# EAGLE design Plan_04_neu_02 (EAGLE 8.3.1)
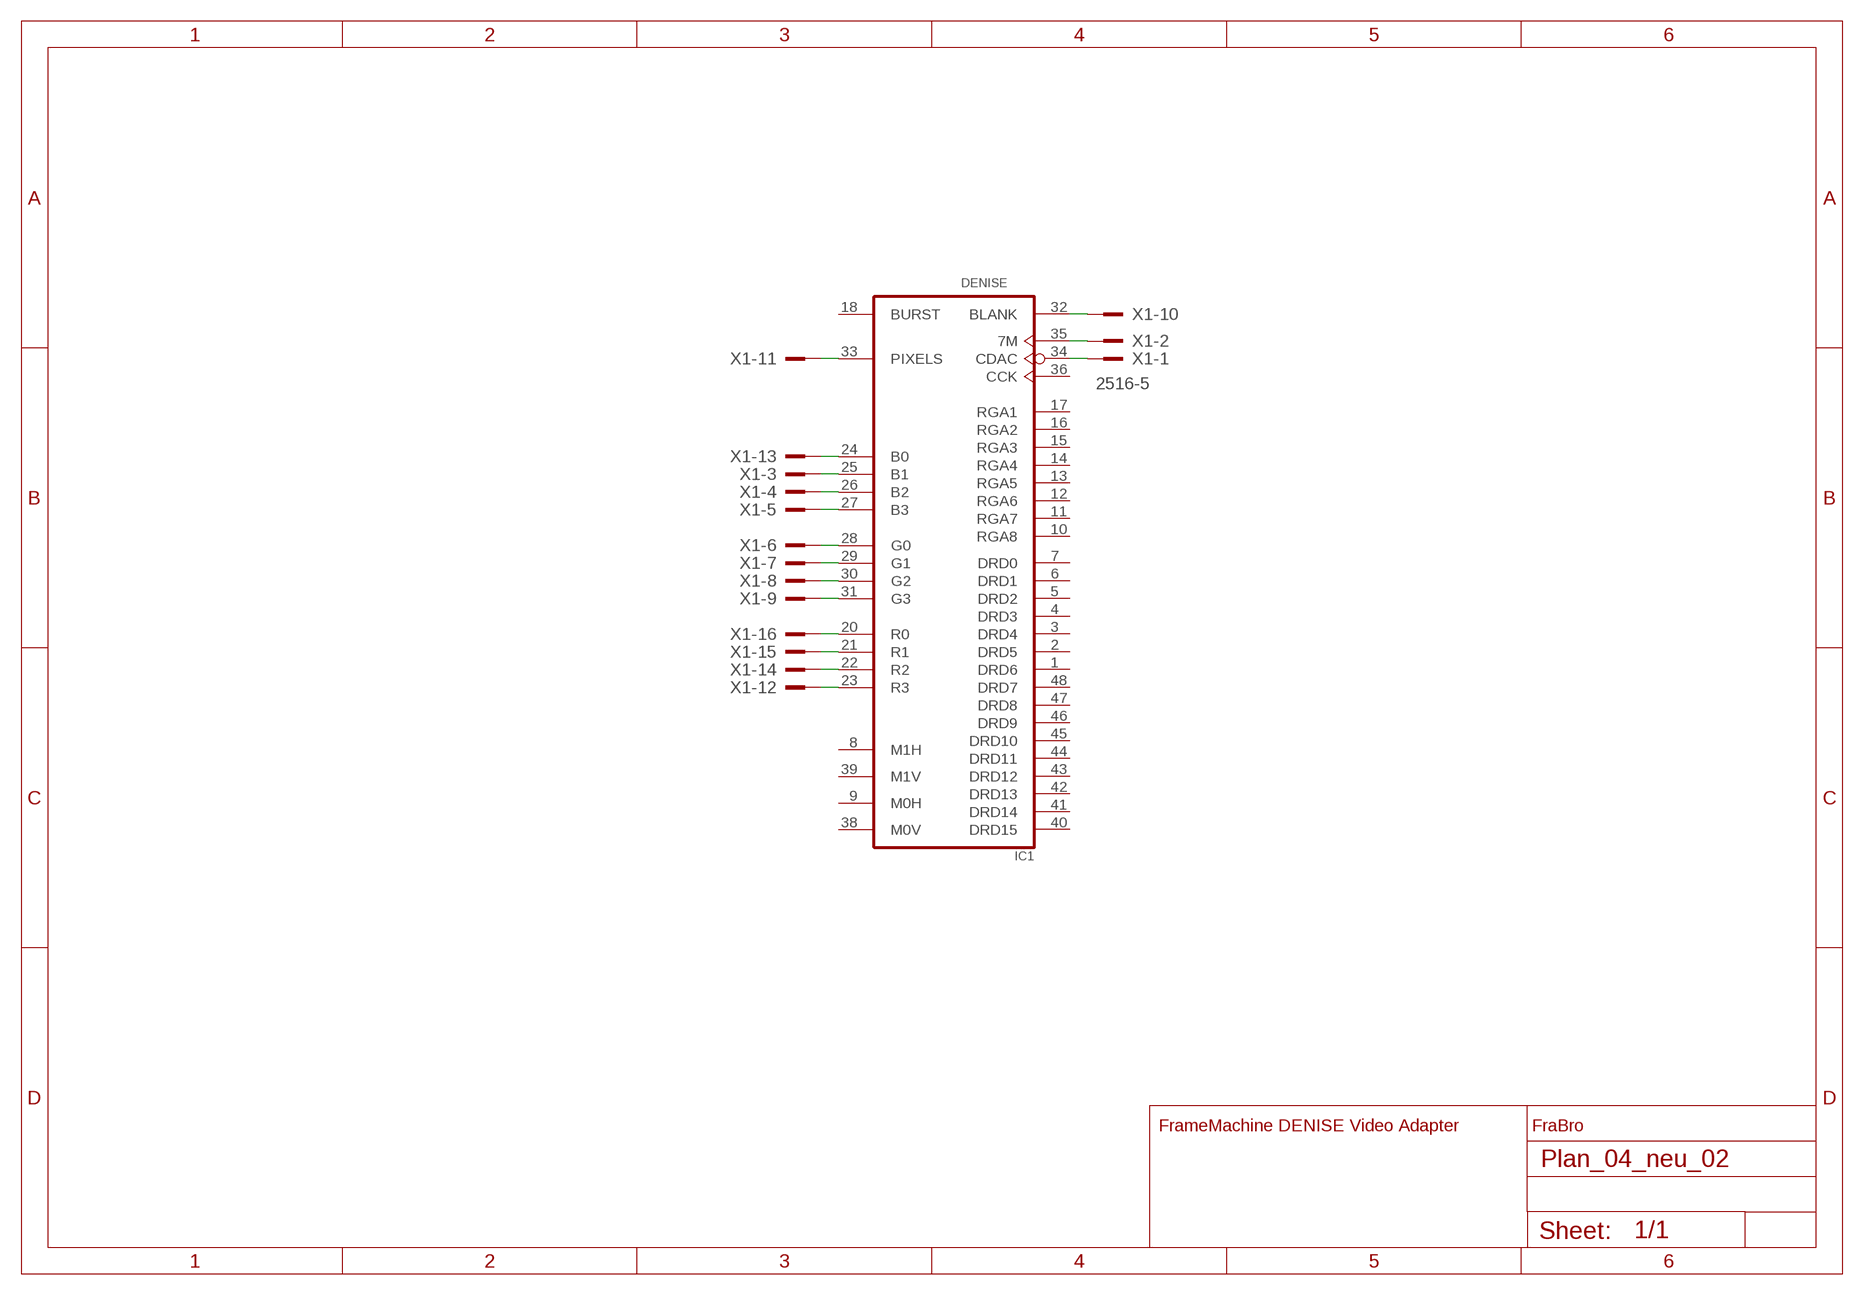
[diagram p0: schematic, sheet 1]

## Parts
IC1  Plug Socket  DENISE_DIP  [DIP48-6]
X1  2516-5  [PAK100/2500-5-16]

## Nets
N$1: IC1.20(R0) X1.16
N$2: IC1.21(R1) X1.15
N$3: IC1.22(R2) X1.14
N$4: IC1.24(B0) X1.13
N$5: IC1.23(R3) X1.12
N$6: IC1.33(PIXELS) X1.11
N$7: IC1.30(G2) X1.8
N$8: IC1.32(BLANK) X1.10
N$9: IC1.31(G3) X1.9
N$10: IC1.29(G1) X1.7
N$11: IC1.28(G0) X1.6
N$12: IC1.27(B3) X1.5
N$13: IC1.25(B1) X1.3
N$14: IC1.26(B2) X1.4
N$15: IC1.35(7M) X1.2
N$16: IC1.34(CDAC) X1.1
Unconnected: IC1.1(DRD6) IC1.2(DRD5) IC1.3(DRD4) IC1.4(DRD3) IC1.5(DRD2) IC1.6(DRD1) IC1.7(DRD0) IC1.8(M1H) IC1.9(M0H) IC1.10(RGA8) IC1.11(RGA7) IC1.12(RGA6) IC1.13(RGA5) IC1.14(RGA4) IC1.15(RGA3) IC1.16(RGA2) IC1.17(RGA1) IC1.18(BURST) IC1.36(CCK) IC1.38(M0V) IC1.39(M1V) IC1.40(DRD15) IC1.41(DRD14) IC1.42(DRD13) IC1.43(DRD12) IC1.44(DRD11) IC1.45(DRD10) IC1.46(DRD9) IC1.47(DRD8) IC1.48(DRD7)

## Notes on the sheet
- FrameMachine DENISE Video Adapter | FraBro

## Power pins joined to a net without a drawn wire
GND1: IC1.37(GND1)
VCC1: IC1.19(VCC1)

## Library data of the parts
IC1 = Amiga:DENISE
X1 = con-3m:2516-: 3M (TM) Pak 100 4-Wall Header Source: 3M; MPN: D2516-5002-AR; OC_FARNELL: 9838376; OC_NEWARK: 12P7055

## Board
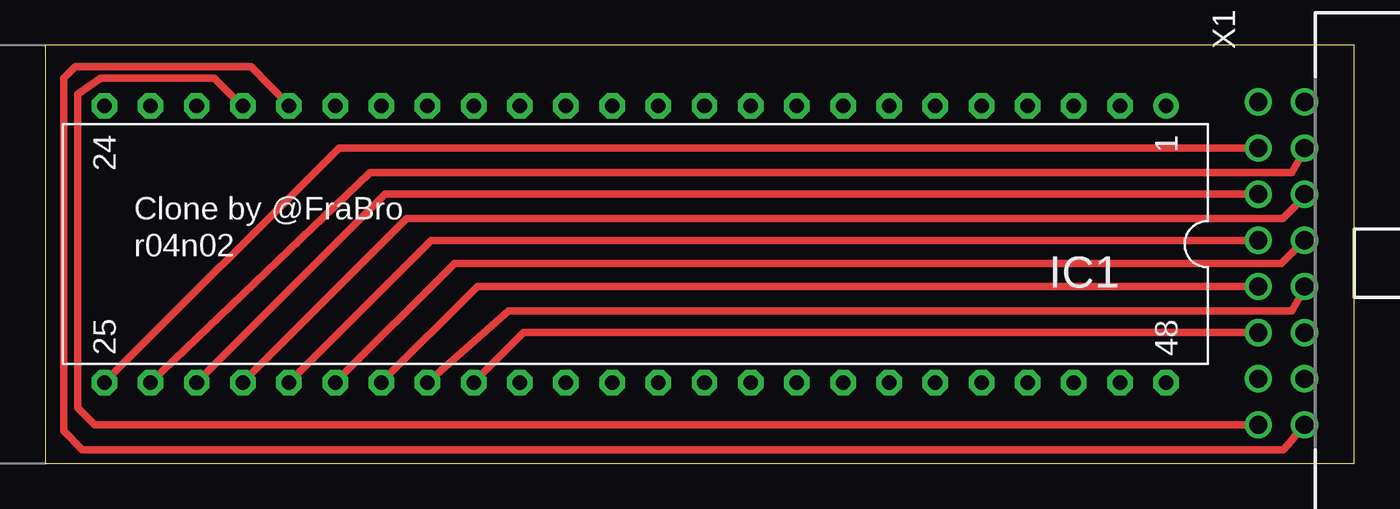
[diagram p1: board, top side]
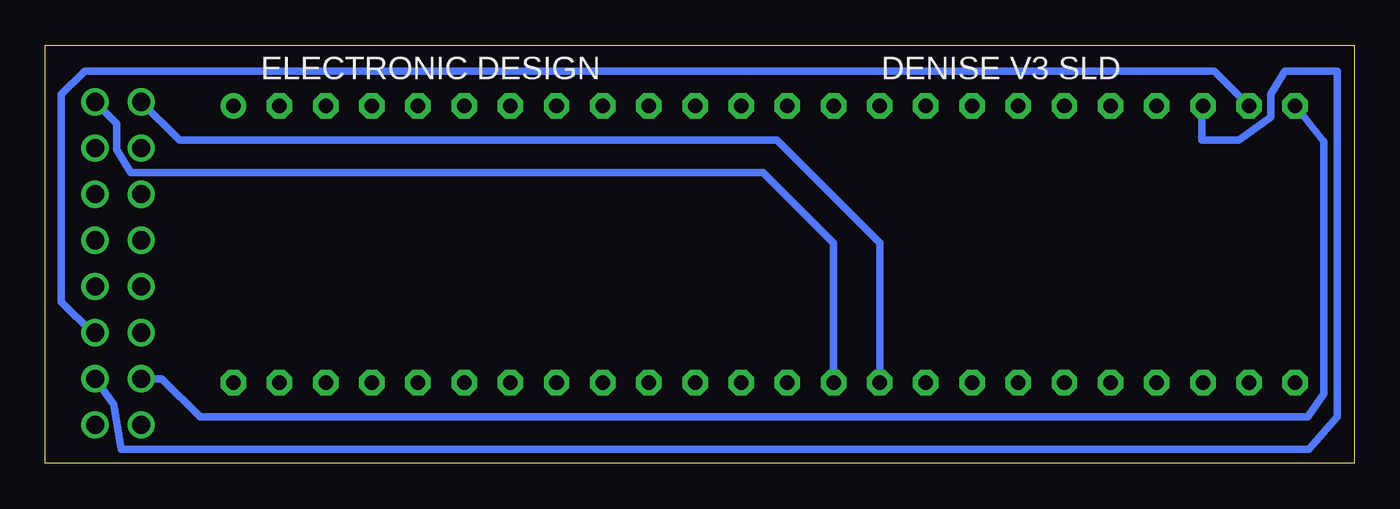
[diagram p2: board, bottom side, seen from below]

Size 72 x 23 mm. Coordinates in mm from the lower left corner, seen from the top.
Outline: 0,0 72,0 72,23 0,23 0,0
Copper layers (1*16): Top 0.0356mm / dielectric 1.5011mm / Bottom 0.0356mm
Design rules "oshpark-2layer": minimum track width 6mil, minimum drill 13mil, track to track 6mil, track to pad 6mil, pad to pad 6mil, via to via 6mil, smd to smd 6mil, copper to edge 15mil, drill to drill 6mil, minimum pad ring 7mil, minimum via ring 7mil, stop-mask expansion 2.5mil, vias tented up to drill 0mil, thermal gap 10mil

### Footprints (pad centres in the part's own frame; a part is rotated, then mirrored left to right if it is on the bottom)
DIP48-6 = drill 0.8 pad 1.4: 1 -27.94,-7.62 | drill 0.8 pad 1.4 octagon: 2 -25.4,-7.62; 3 -22.86,-7.62; 4 -20.32,-7.62; 5 -17.78,-7.62; 6 -15.24,-7.62; 7 -12.7,-7.62; 8 -10.16,-7.62; 9 -7.62,-7.62; 10 -5.08,-7.62; 11 -2.54,-7.62; 12 0,-7.62; 13 2.54,-7.62; 14 5.08,-7.62; 15 7.62,-7.62; 16 10.16,-7.62; 17 12.7,-7.62; 18 15.24,-7.62; 19 17.78,-7.62; 20 20.32,-7.62; 21 22.86,-7.62; 22 25.4,-7.62; 23 27.94,-7.62; 24 30.48,-7.62; 25 30.48,7.62; 26 27.94,7.62; 27 25.4,7.62; 28 22.86,7.62; 29 20.32,7.62; 30 17.78,7.62; 31 15.24,7.62; 32 12.7,7.62; 33 10.16,7.62; 34 7.62,7.62; 35 5.08,7.62; 36 2.54,7.62; 37 0,7.62; 38 -2.54,7.62; 39 -5.08,7.62; 40 -7.62,7.62; 41 -10.16,7.62; 42 -12.7,7.62; 43 -15.24,7.62; 44 -17.78,7.62; 45 -20.32,7.62; 46 -22.86,7.62; 47 -25.4,7.62; 48 -27.94,7.62
PAK100/2500-5-16 = drill 1 pad 1.422: 1 -8.89,-1.27; 2 -8.89,1.27; 3 -6.35,-1.27; 4 -6.35,1.27; 5 -3.81,-1.27; 6 -3.81,1.27; 7 -1.27,-1.27; 8 -1.27,1.27; 9 1.27,-1.27; 10 1.27,1.27; 11 3.81,-1.27; 12 3.81,1.27; 13 6.35,-1.27; 14 6.35,1.27; 15 8.89,-1.27; 16 8.89,1.27

### Placement (x,y rotation side)
IC1  33.72,12.06 180 top
X1  68,11 270 top

### Tracks (layer width: path | path; a pad name or v marks a point on that pad's centre or on a via)
N$1
  Top 0.406: X1.16 68.99,1.83 68.58,1.27 68.1,0.74 2.03,0.74 1.02,1.78 1.02,21.18 1.65,21.82 11.31,21.82 IC1.20
N$2
  Top 0.406: X1.15 2.72,2.11 1.78,3.05 1.78,20.32 3.05,21.18 9.3,21.18 10.8,19.68 IC1.21
N$3
  Bottom 0.406: X1.14 68.25,3.23 67.82,0.76 2.49,0.76 0.91,2.54 0.91,21.59 3.81,21.59 4.57,20.32 4.57,19.05 6.35,17.78 8.38,17.78 8.38,19.11 IC1.22
N$4
  Bottom 0.406: X1.13 65.61,4.65 63.5,2.54 2.54,2.54 1.68,3.81 1.68,17.71 IC1.24
N$5
  Bottom 0.406: X1.12 69.42,7.19 71.12,8.89 71.12,20.32 69.85,21.59 7.69,21.59 IC1.23
N$6
  Top 0.406: X1.11 26.31,7.19 IC1.33
N$7
  Top 0.406: X1.8 68,11 22.5,11 IC1.30
N$8
  Top 0.406: X1.10 69.27,9.58 68.58,8.38 25.47,8.38 IC1.32
N$9
  Top 0.406: X1.9 23.77,9.73 IC1.31
N$10
  Top 0.406: X1.7 21.23,12.27 IC1.29
N$11
  Top 0.406: X1.6 69.27,14.66 68.07,13.46 19.88,13.46 IC1.28
N$12
  Top 0.406: X1.5 18.69,14.81 IC1.27
N$13
  Top 0.406: X1.3 16.15,17.35 IC1.25
N$14
  Top 0.406: X1.4 69.27,17.2 68.58,16 17.85,16 IC1.26
N$15
  Bottom 0.406: IC1.35 28.64,12.13 32.51,16 67.31,16 68.07,17.27 68.07,18.69 X1.2
N$16
  Bottom 0.406: IC1.34 26.1,12.13 31.75,17.78 64.62,17.78 X1.1

### Text on the board
tNames: Clone by @FraBro | r04n02
bNames: DENISE V3 SLD | ELECTRONIC DESIGN